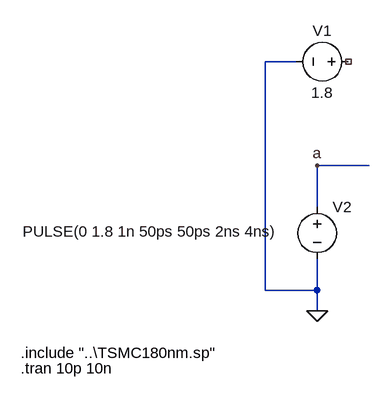
[diagram p0: schematic Draft1.asc]
Draft1.asc, the LTspice schematic file:
Version 4
SHEET 1 880 680
WIRE 160 -32 112 -32
WIRE 272 128 192 128
WIRE 192 192 192 128
WIRE 112 320 112 -32
WIRE 192 320 192 272
WIRE 192 320 112 320
WIRE 192 352 192 320
FLAG 192 128 a
FLAG 192 352 0
SYMBOL voltage 256 -32 R90
WINDOW 0 -32 56 VBottom 2
WINDOW 3 32 56 VTop 2
WINDOW 123 0 0 Left 0
WINDOW 39 0 0 Left 0
SYMATTR InstName V1
SYMATTR Value 1.8
SYMBOL voltage 192 176 R0
WINDOW 3 -453 53 Left 2
WINDOW 123 0 0 Left 0
WINDOW 39 0 0 Left 0
SYMATTR Value PULSE(0 1.8 1n 50ps 50ps 2ns 4ns)
SYMATTR InstName V2
TEXT -264 416 Left 2 !.include "..\\TSMC180nm.sp"
TEXT -264 440 Left 2 !.tran 10p 10n

The netlist it stands for:
* Draft1.asc
V1 NC_01 0 1.8
V2 a 0 PULSE(0 1.8 1n 50ps 50ps 2ns 4ns)
.include "..\TSMC180nm.sp"
.tran 10p 10n
.backanno
.end